# EAGLE design LedController (EAGLE 7.5.0)
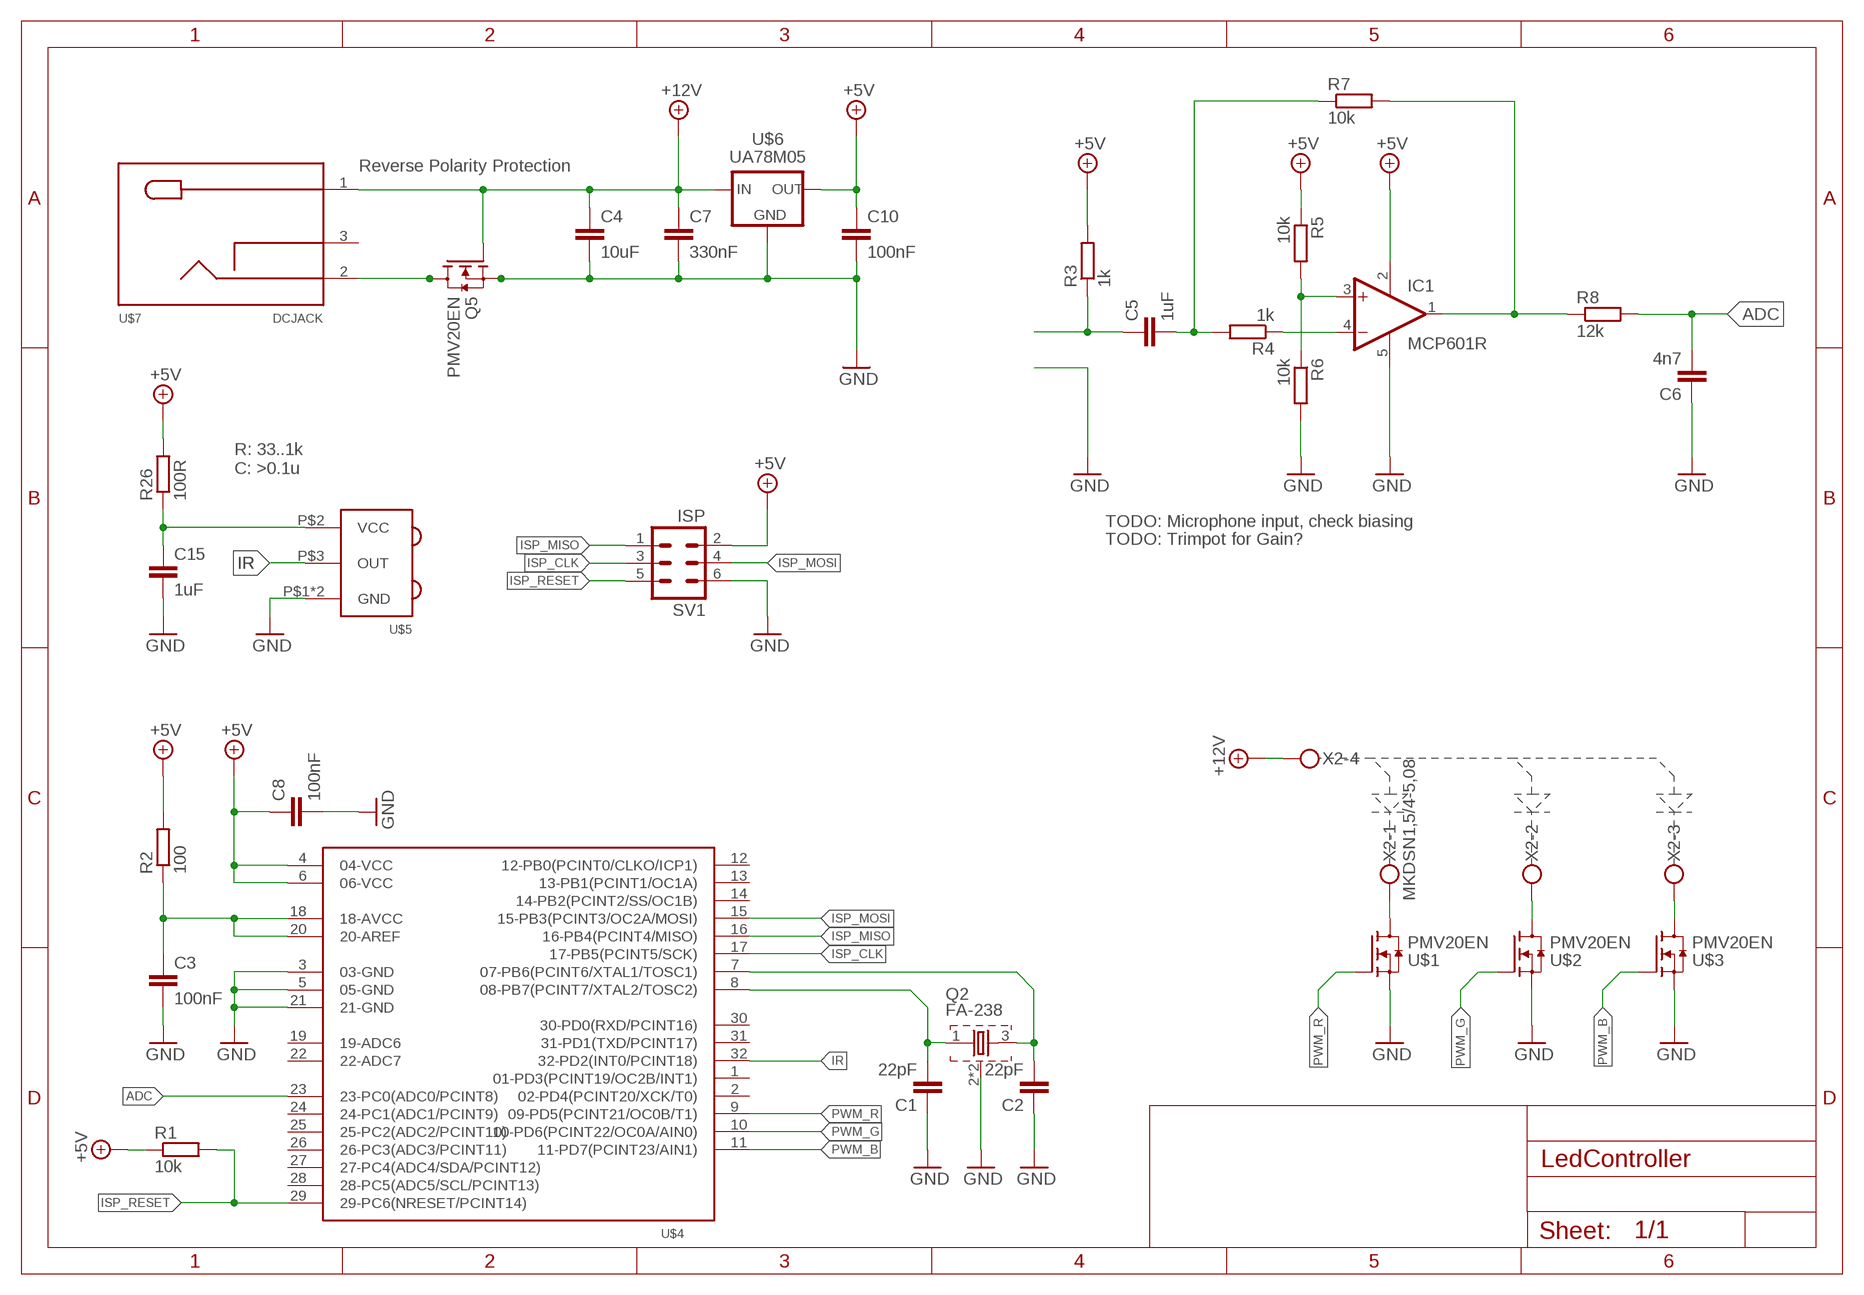
[diagram p0: schematic, sheet 1]

## Parts
C1  22pF  C-EUC0805  [C0805]
C2  22pF  C-EUC0805  [C0805]
C3  100nF  C-EUC0805  [C0805]
C4  10uF  C-EUC0805  [C0805]
C5  1uF  C-EUC0805  [C0805]
C6  4n7  C-EUC0805  [C0805]
C7  330nF  C-EUC0805  [C0805]
C8  100nF  C-EUC0805  [C0805]
C10  100nF  C-EUC0805  [C0805]
C15  1uF  C-EUC0805  [C0805]
IC1  MCP601R  [SOT23-5]
Q2  FA-238  [FA-238]
Q5  PMV20EN  [SOT23]
R1  10k  R-EU_R0805  [R0805]
R2  100  R-EU_R0805  [R0805]
R3  1k  R-EU_M0805  [M0805]
R4  1k  R-EU_R0805  [R0805]
R5  10k  R-EU_R0805  [R0805]
R6  10k  R-EU_R0805  [R0805]
R7  10k  R-EU_R0805  [R0805]
R8  12k  R-EU_R0805  [R0805]
R26  100R  R-EU_R0805  [R0805]
SV1  ISP  MA03-2  [MA03-2]
U$1  PMV20EN  [SOT23]
U$2  PMV20EN  [SOT23]
U$3  PMV20EN  [SOT23]
U$4  ATMEGA328  [TQFP32]
U$5  TSOP75236  [TSOP75236]
U$6  UA78M05  [SOT-223]
U$7  DCJACK  [DCJACK]
X2  MKDSN1,5/4-5,08  [MKDSN1,5/4-5,08]

## Nets
+5V [+5V]: C8.1 C10.1 IC1.2(V+) R1.1 R2.2 R3.2 R5.1 R26.2 SV1.2 U$4.4(04-VCC) U$4.6(06-VCC) U$6.3(OUT)
+12V [+12V]: C4.1 C7.1 Q5.1(G) U$6.1(IN) U$7.1 X2.4
ADC: C6.2 R8.2 U$4.23(23-PC0(ADC0/PCINT8))
GND: C1.1 C2.1 C3.2 C4.2 C6.1 C7.2 C8.2 C10.2 C15.2 IC1.5(V-) Q2.2 Q2.4 Q5.2(S) R6.2 SV1.6 U$1.2(S) U$2.2(S) U$3.2(S) U$4.3(03-GND) U$4.5(05-GND) U$4.21(21-GND) U$5.P$1(GND) U$5.P$4(GND) U$6.2(GND) U$6.TER(GND)
IR: U$4.32(32-PD2(INT0/PCINT18)) U$5.P$3(OUT)
ISP_CLK: SV1.3 U$4.17(17-PB5(PCINT5/SCK))
ISP_MISO: SV1.1 U$4.16(16-PB4(PCINT4/MISO))
ISP_MOSI: SV1.4 U$4.15(15-PB3(PCINT3/OC2A/MOSI))
ISP_RESET: R1.2 SV1.5 U$4.29(29-PC6(NRESET/PCINT14))
N$1: C5.1 R3.1
N$4: U$1.3(D) X2.1
N$5: U$2.3(D) X2.2
N$6: U$3.3(D) X2.3
N$7: C3.1 R2.1 U$4.18(18-AVCC) U$4.20(20-AREF)
N$8: Q5.3(D) U$7.2
N$9: C5.2 R4.2 R7.1
N$10: IC1.4(-IN) R4.1
N$11: IC1.3(+IN) R5.2 R6.1
N$12: IC1.1(OUT) R7.2 R8.1
N$13: C1.2 Q2.1 U$4.8(08-PB7(PCINT7/XTAL2/TOSC2))
N$14: C2.2 Q2.3 U$4.7(07-PB6(PCINT6/XTAL1/TOSC1))
N$63 [+5V]: C15.1 R26.1 U$5.P$2(VCC)
PWM_B: U$3.1(G) U$4.11(11-PD7(PCINT23/AIN1))
PWM_G: U$2.1(G) U$4.10(10-PD6(PCINT22/OC0A/AIN0))
PWM_R: U$1.1(G) U$4.9(09-PD5(PCINT21/OC0B/T1))
Unconnected: U$4.1(01-PD3(PCINT19/OC2B/INT1)) U$4.2(02-PD4(PCINT20/XCK/T0)) U$4.12(12-PB0(PCINT0/CLKO/ICP1)) U$4.13(13-PB1(PCINT1/OC1A)) U$4.14(14-PB2(PCINT2/SS/OC1B)) U$4.19(19-ADC6) U$4.22(22-ADC7) U$4.24(24-PC1(ADC1/PCINT9)) U$4.25(25-PC2(ADC2/PCINT10)) U$4.26(26-PC3(ADC3/PCINT11)) U$4.27(27-PC4(ADC4/SDA/PCINT12)) U$4.28(28-PC5(ADC5/SCL/PCINT13)) U$4.30(30-PD0(RXD/PCINT16)) U$4.31(31-PD1(TXD/PCINT17)) U$7.3

## Notes on the sheet
- Reverse Polarity Protection
- R: 33..1k
  C: >0.1u
- TODO: Microphone input, check biasing
- TODO: Trimpot for Gain?

## Library data of the parts
C1-C8 C10 C15 = rcl:C-EU: CAPACITOR, European symbol
IC1 = linear:MCP601: Single Op Amp 2.7V to 6.0V Single Supply CMOS Source: http://ww1.microchip.com/downloads/en/DeviceDoc/21314g.pdf
Q2 = LedController:FA-238: MHz RANGE CRYSTAL UNIT Source: Epson Toyocom
Q5 U$1-U$3 = LedController:PMV20EN: 30 V, N-channel Trench MOSFET
R1-R8 R26 = rcl:R-EU_: RESISTOR, European symbol
SV1 = con-lstb:MA03-2: PIN HEADER; OC_FARNELL: unknown; OC_NEWARK: unknown
U$4 = LedController:ATMEGA328
U$5 = LedController:TSOP75236: IR Receiver Module for Remote Control Systems
U$6 = LedController:UA78M05
U$7 = LedController:DCJACK
X2 = con-phoenix-508:MKDSN1,5/4-5,08: MKDSN 1,5/ 4-5,08 Printklemme Nennstrom: 13,5 A Nennspannung: 250 V Rastermaß: 5,08 mm Polzahl: 4 Anschlussart: Schraubanschluss Montage: Löten Anschlussrichtung Leiter/Platine: 0 ° Artikelnummer: 1729144 Source: http://eshop.phoenixcontact.com .. 1729144.pdf

## Net classes
0 default: width 0.4 mm
1 +12V: width 0.406 mm

## Board
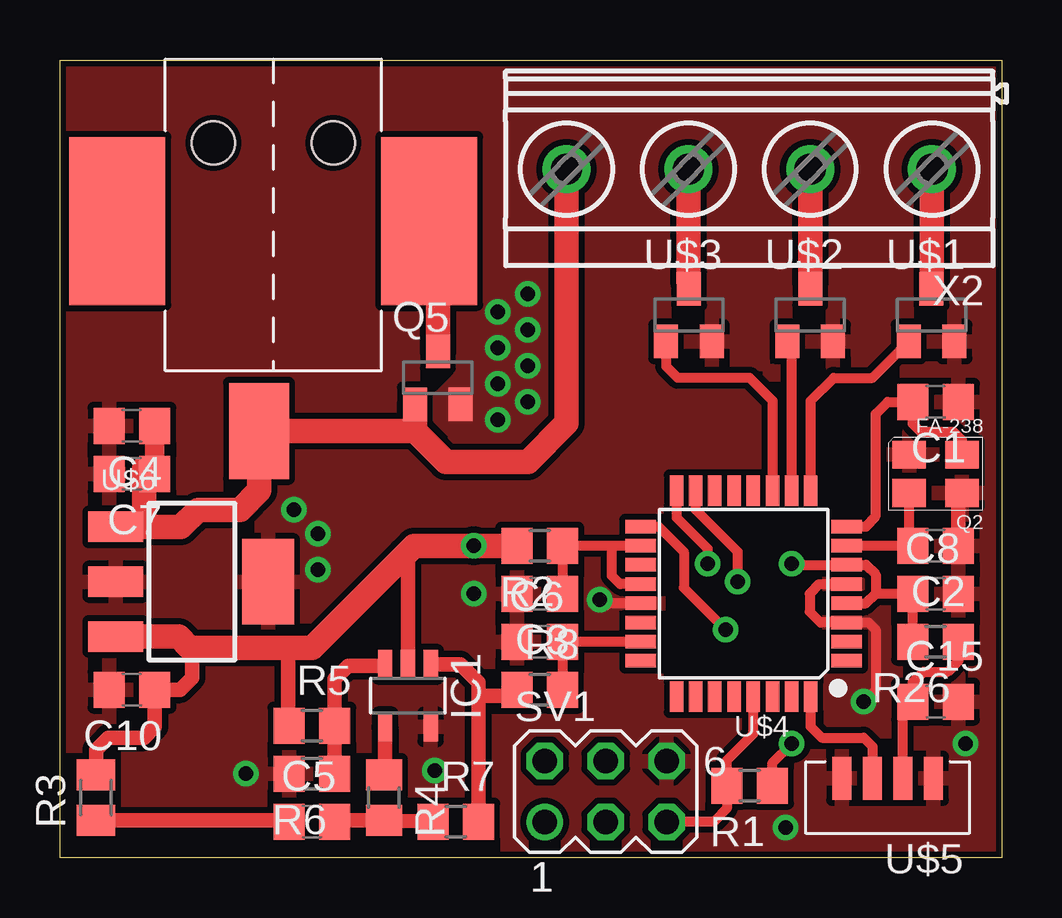
[diagram p1: board, top side]
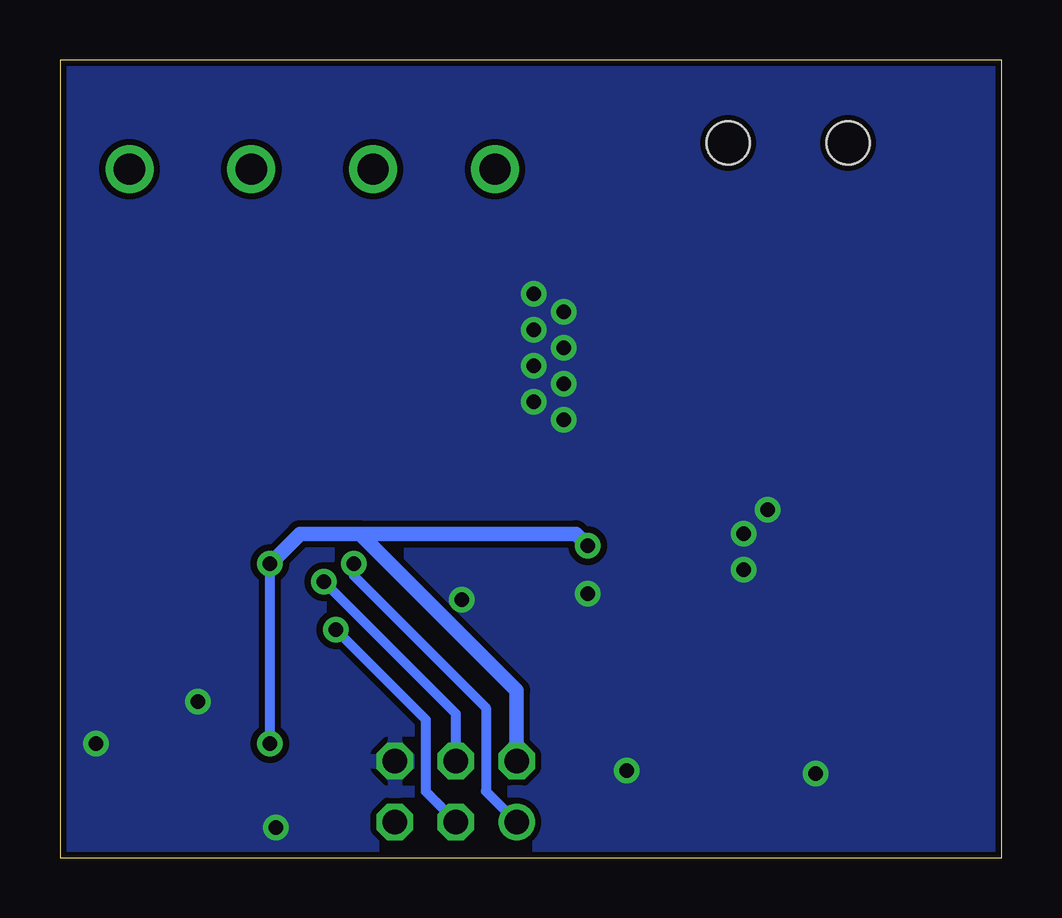
[diagram p2: board, bottom side, seen from below]

Size 39.25 x 33.25 mm. Coordinates in mm from the lower left corner, seen from the top.
Outline: 0,0 0,33.25 39.25,33.25 39.25,0 0,0
Copper layers (1*16): Top 0.035mm / dielectric 1.5mm / Bottom 0.035mm
Design rules "SeeedStudio_2layer_DRU_no_angle_20140221 *": minimum track width 6mil, minimum drill 12mil, track to track 6mil, track to pad 6mil, pad to pad 6mil, via to via 6mil, smd to smd 0mil, copper to edge 10mil, drill to drill 10mil, minimum pad ring 10mil, minimum via ring 6mil, stop-mask expansion 2mil, vias tented up to drill 100mil, thermal gap 10mil

### Footprints (pad centres in the part's own frame; a part is rotated, then mirrored left to right if it is on the bottom)
C0805 = smd 1.3 x 1.5: 1 -0.95,0; 2 0.95,0
SOT23-5 = smd 0.6 x 1.2: 1 -0.95,-1.306; 2 0,-1.306; 3 0.95,-1.306; 4 0.95,1.306; 5 -0.95,1.306
FA-238 = smd 1.4 x 1.15: 1 -1.1,-0.8; 2 1.1,-0.8; 3 1.1,0.8; 4 -1.1,0.8
SOT23 = smd 1 x 1.4: 1 -0.95,-1.1; 2 0.95,-1.1; 3 0,1.1
R0805 = smd 1.3 x 1.5: 1 -0.95,0; 2 0.95,0
M0805 = smd 1.3 x 1.6: 1 -0.95,0; 2 0.95,0
MA03-2 = drill 1.016: 1 -2.54,-1.27 | drill 1.016 octagon: 2 -2.54,1.27; 3 0,-1.27; 4 0,1.27; 5 2.54,-1.27; 6 2.54,1.27
TQFP32 = smd 1.27 x 0.559: 1 -4.293,2.8; 2 -4.293,2; 3 -4.293,1.2; 4 -4.293,0.4; 5 -4.293,-0.4; 6 -4.293,-1.2; 7 -4.293,-2; 8 -4.293,-2.8; 17 4.293,-2.8; 18 4.293,-2; 19 4.293,-1.2; 20 4.293,-0.4; 21 4.293,0.4; 22 4.293,1.2; 23 4.293,2; 24 4.293,2.8 | smd 0.559 x 1.27: 9 -2.8,-4.293; 10 -2,-4.293; 11 -1.2,-4.293; 12 -0.4,-4.293; 13 0.4,-4.293; 14 1.2,-4.293; 15 2,-4.293; 16 2.8,-4.293; 25 2.8,4.293; 26 2,4.293; 27 1.2,4.293; 28 0.4,4.293; 29 -0.4,4.293; 30 -1.2,4.293; 31 -2,4.293; 32 -2.8,4.293
TSOP75236 = smd 0.8 x 1.8: P$1 -1.905,-0.8; P$2 -0.635,-0.8; P$3 0.635,-0.8; P$4 1.905,-0.8
SOT-223 = smd 1.27 x 2.286: 1 -2.286,-3.175; 2 0,-3.175; 3 2.286,-3.175 | smd 3.556 x 2.159: TER 0,3.175
DCJACK = smd 4 x 2.5: 1 15.5,-0.6 | smd 7 x 4: 2 6.75,6.5; 3 6.75,-6.5 | hole 1.8: 3.5,2.5; 3.5,-2.5
MKDSN1,5/4-5,08 = drill 1.3 pad 2: 1 -7.641,0.025; 2 -2.561,0.025; 3 2.519,0.025; 4 7.599,0.025

### Placement (x,y rotation side)
C1  36.5,19 180 top
C2  36.5,13 180 top
C3  20,11 180 top
C4  3,18 180 top
C5  10.5,1.5 0 top
C6  20,9 0 top
C7  3,16 180 top
C8  36.5,11 0 top
C10  3,7 180 top
C15  36.5,6.5 0 top
IC1  14.5,6.75 180 top
Q2  36.5,16 180 top
Q5  15.75,20 0 top
R1  28.75,3 180 top
R2  20,13 180 top
R3  1.5,2.5 90 top
R4  13.5,2.5 270 top
R5  10.5,5.5 0 top
R6  10.5,3.5 180 top
R7  16.5,1.5 0 top
R8  20,7 0 top
R26  36.5,9 180 top
SV1  22.75,2.75 0 top
U$1  36.33,22.61 0 top
U$2  31.28,22.61 0 top
U$3  26.22,22.61 0 top
U$4  28.5,11 180 top
U$5  34.5,2.5 180 top
U$6  5.5,11.5 270 top
U$7  8.89,33.29 270 top
X2  28.71,28.72 180 top

### Tracks (layer width: path | path; a pad name or v marks a point on that pad's centre or on a via)
+5V  (via drill 0.6)
  Top 0.406: 35.25,10.7 arc90 C8.1 | 35.35,10.7 arc-90 C8.1 | U$4.4 33.6,10.6 34,11 | 34,11 34,11.8 33.6,12.2 U$4.6 30.3,12.2 v30.5,12.25 | R26.2 C8.1 | C8.1 34,11 | R1.1 29.7,3.95 v30.5,4.75
  Top 0.61: 9.5,5.45 R5.1 9.5,5.55 9.5,8.5 9.25,8.75 | R3.2 1.5,4.5 2,5 3.5,5 3.95,5.45 C10.1 5,7 5.5,7.5 5.5,8.66 5.41,8.75 | IC1.2 14.5,12.5 14.38,12.62
  Top 1.016: R2.2 v17.25,13 14.75,13 14.38,12.62 10.5,8.75 9.25,8.75 5.41,8.75 4.95,9.21 U$6.3
  Bottom 0.406: v30.5,4.75 v30.5,12.25
  Bottom 0.61: v30.5,12.25 29.25,13.5 26.75,13.5 | SV1.2 20.21,6.96 26.75,13.5 | 26.75,13.5 17.75,13.5 v17.25,13
+12V
  Top 0.813: C7.1 C4.1 | 8.25,17.75 U$7.1
  Top 1.016: X2.4 21.11,18.11 19.5,16.5 16.09,16.5 14.8,17.79 | 14.8,17.79 U$7.1 8.29,15.29 7.5,14.5 5.75,14.5 5.04,13.79 U$6.1 3.5,14.04 3.5,16.25 C7.1 | 14.8,17.79 Q5.1
ADC
  Top 0.406: U$4.23 C6.2 R8.2
  Top 0.61: 20.95,8.8 C6.2
GND  (via drill 0.6)
  Top 0.406: U$4.5 31.65,11.4 31.25,11 31.25,10.25 31.7,9.8 U$4.3 33.7,9.8 34,9.5 34,7 v33.5,6.5 | U$4.21 22.85,10.6 22.75,10.5
  Top 0.61: Q2.4 37.45,15.05 C2.1
  other vias: 22.5,10.75 18.25,19.75 19.5,20.5 18.25,21.25 19.5,22 18.25,22.75 19.5,23.5 19.5,19 18.25,18.25 30.25,1.25 37.75,4.75 17.25,11 15.62,3.62 9.75,14.5 10.75,13.5 10.75,12 7.75,3.5
  pour Top (isolate 0.254): 0,33.29 0,0 39.27,0 39.27,33.29
  pour Bottom (isolate 0.254): 0,33.29 0,0 39.27,0 39.27,33.29
  pour Top (no thermals): 15.75,19.25 16.5,20 17.75,20 17.75,17.75 16.25,17.75 15.75,18.25
IR
  Top 0.406: U$5.P$3 33.87,4.63 33.5,5 31.75,5 31.3,5.45 U$4.32
ISP_CLK  (via drill 0.6)
  Top 0.406: U$4.17 24.95,13.8 26,12.75 26,11.25 v27.75,9.5
  Bottom 0.406: SV1.3 22.75,1.5 24,2.75 24,5.75 v27.75,9.5
ISP_MISO  (via drill 0.6)
  Top 0.406: U$4.16 25.7,14.18 27,12.88 v27,12.25
  Bottom 0.406: v27,12.25 27,11.75 21.5,6.25 21.5,2.77 SV1.1
ISP_MOSI  (via drill 0.6)
  Top 0.406: v28.25,11.5 28.25,12.75 26.5,14.5 U$4.15
  Bottom 0.406: SV1.4 22.75,6 v28.25,11.5
ISP_RESET
  Top 0.406: U$4.29 28.9,5.15 27.8,4.05 R1.2 27.8,2.05 27.25,1.5 25.31,1.5 SV1.5
N$1
  Top 0.61: R3.1 9.5,1.55 C5.1
N$2
  cutout Top: 25.25,14.25 31.75,14.25 31.75,7.75 25.25,7.75
N$4
  Top 0.406: U$1.3 36.35,23.99
  Top 1.016: 36.35,23.99 X2.1
N$5
  Top 0.406: U$2.3 31.27,23.97
  Top 1.016: 31.27,23.97 X2.2
N$6
  Top 0.406: U$3.3 26.19,23.99
  Top 1.016: 26.19,23.99 X2.3
N$7
  Top 0.406: C3.1 R2.1 23,13 | U$4.18 23,13 | U$4.20 23.35,11.4 23,11.75 23,13
N$8
  Top 1.016: Q5.3 15.75,26.18 U$7.2
N$9
  Top 0.61: C5.2 11.25,1.55 R4.2 R7.1
N$10
  Top 0.61: IC1.4 13.55,3.9 R4.1
N$11
  Top 0.61: R6.1 R5.2 11.45,7.45 12,8 13.49,8 IC1.3
N$12
  Top 0.61: IC1.1 16.69,8.06 17.45,7.3 17.45,6.75 | R8.1 19,7.05 19,6.75 17.45,6.75 | R7.2 17.45,6.75
N$13
  Top 0.406: U$4.8 33.6,13.8 34,14.25 34,18.5 34.5,19 C1.2 35.55,18.07 35.88,17.75 37.25,17.75 37.6,17.4 Q2.1
N$14
  Top 0.406: 35.45,13.1 arc-90 C2.2 35.4,13.15 | 35.4,13.15 35.25,13 U$4.7 | 35.4,13.15 Q2.3
N$63
  Top 0.406: U$5.P$2 35.13,6.08 C15.1 35.55,7.3 36,7.75 37,7.75 37.45,8.2 R26.1
PWM_B
  Top 0.406: U$3.1 25.27,20.48 25.75,20 28.75,20 29.7,19.05 U$4.11
PWM_G
  Top 0.406: U$4.10 30.5,21.34 U$2.1
PWM_R
  Top 0.406: U$1.1 33.87,20 32.25,20 31.3,19.05 U$4.9